# EAGLE design Osilatör (EAGLE 9.6.2)
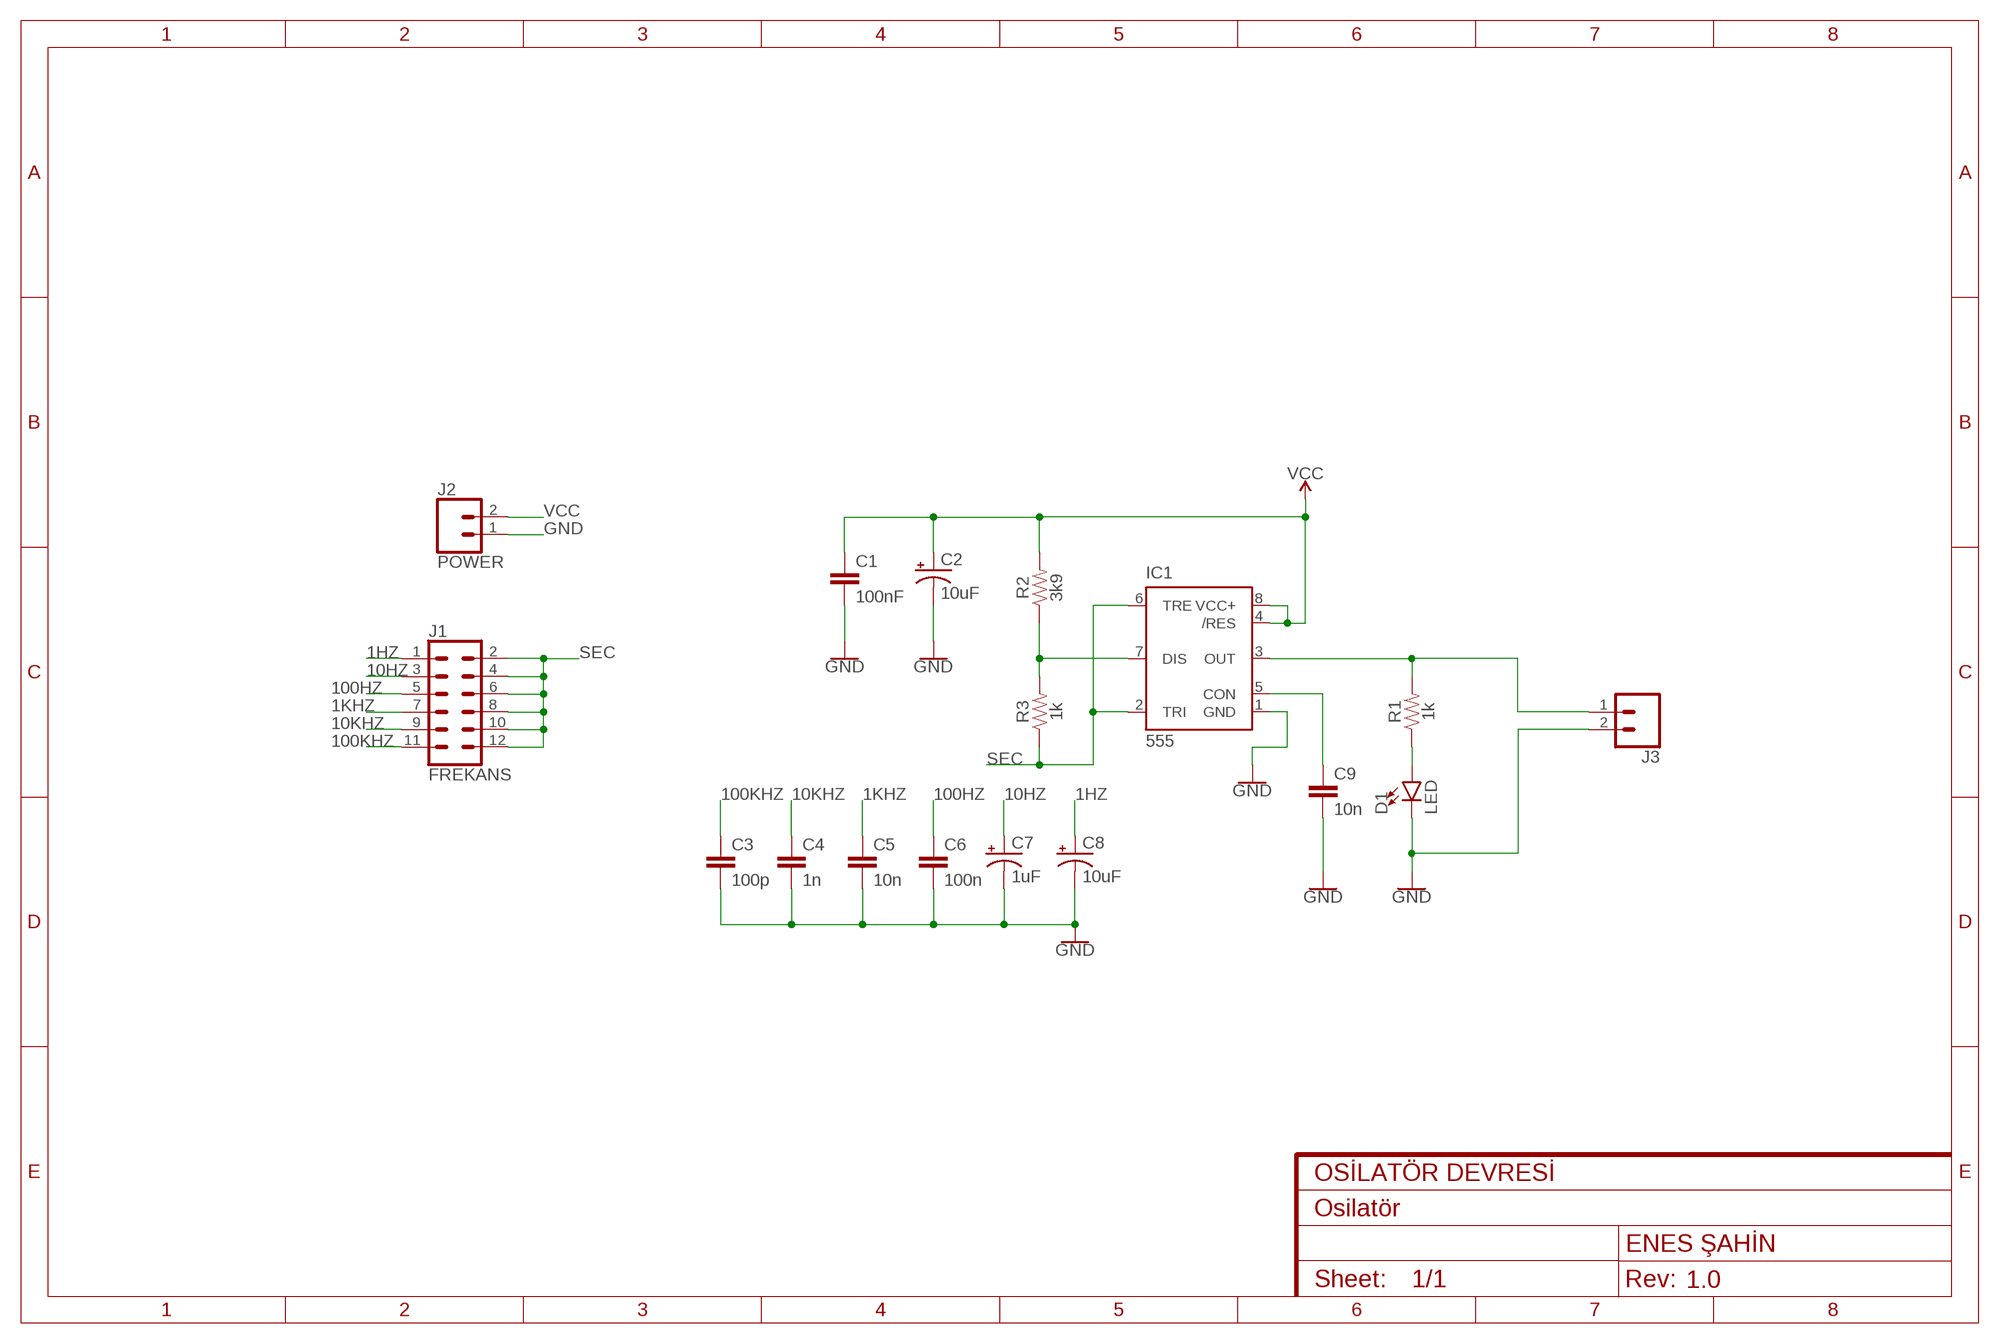
[diagram p0: schematic, sheet 1]
FRAME1 (FRAME-A4L): CNAME: OSİLATÖR DEVRESİ; CREVISION: 1.0; DESIGNER: ENES ŞAHİN

## Parts
C1  100nF  C2,5-3  [C2.5-3]
C2  10uF  100UF-POLAR-RADIAL-2.5MM-25V-20%  [CPOL-RADIAL-2.5MM-6.5MM]
C3  100p  C2,5-3  [C2.5-3]
C4  1n  C2,5-3  [C2.5-3]
C5  10n  C2,5-3  [C2.5-3]
C6  100n  C2,5-3  [C2.5-3]
C7  1uF  100UF-POLAR-RADIAL-2.5MM-25V-20%  [CPOL-RADIAL-2.5MM-6.5MM]
C8  10uF  100UF-POLAR-RADIAL-2.5MM-25V-20%  [CPOL-RADIAL-2.5MM-6.5MM]
C9  10n  C2,5-3  [C2.5-3]
D1  LED  LED-3MM-NO_SILK  [LED_3MM-NS]
IC1  555  555KIT  [DIP08-KIT]
J1  FREKANS  CONN_06X2PTH_FEMALE  [2X6]
J2  POWER  CONN_02  [1X02]
J3  CONN_02  [1X02]
R1  1k  1KOHM-HORIZ-1/4W-1%  [AXIAL-0.3]
R2  3k9  1KOHM-HORIZ-1/4W-1%  [AXIAL-0.3]
R3  1k  1KOHM-HORIZ-1/4W-1%  [AXIAL-0.3]

## Nets
1HZ: C8.1(+) J1.1
1KHZ: C5.1 J1.7
10HZ: C7.1(+) J1.3
10KHZ: C4.1 J1.9
100HZ: C6.1 J1.5
100KHZ: C3.1 J1.11
GND: C1.2 C2.2(-) C3.2 C4.2 C5.2 C6.2 C7.2(-) C8.2(-) C9.2 D1.K(C) IC1.1(GND) J2.1 J3.2
N$1: IC1.3(OUT) J3.1 R1.P$2
N$2: D1.A R1.P$1
N$3: C9.1 IC1.5(CON)
N$7: IC1.7(DIS) R2.P$1 R3.P$2
SEC: IC1.2(TRI) IC1.6(TRE) J1.2 J1.4 J1.6 J1.8 J1.10 J1.12 R3.P$1
VCC: C1.1 C2.1(+) IC1.4(/RES) IC1.8(VCC+) J2.2 R2.P$2

## Library data of the parts
C1 C3-C6 C9 = capacitor-wima:C: CAPACITOR naming: grid - package width
C2 C7 C8 = SparkFun-Capacitors:100UF-POLAR: 100µF polarized capacitors A capacitor is a passive two-terminal electrical component used to store electrical energy temporarily in an electric field.; PROD_ID: CAP-08439; VALUE: 100uF
D1 = SparkFun-LED:LED: LED (Generic) Standard schematic elements and footprints for 5mm, 3mm, 1206, and 0603 sized LEDs. Generic LEDs with no color specified.
IC1 = SparkFun-IC-Special-Function:555: General purpose bipolar Timer Datasheet <http://www.sparkfun.com/datasheets/Components/General/ne555.pdf> SparkFun Products SparkFun SparkPunk Sequencer Kit <https://www.sparkfun.com/products/12707> (KIT-12707) Storefront Component: 555 Timer <https://www.sparkfun.com/products/9273> (COM-09273) Two parts valid for production: VFP: IC-11930 (M7555 PTH) VFP: IC-09173 (555 PTH) - Preferred; PROD_ID: IC-09173; PROD_ID_ALT: IC-11930
J1 = SparkFun-Connectors:CONN_06X2: Multi connection point. Often used as Generic Header-pin footprint for 0.1 inch spaced/style header connections On any of the 0.1 inch spaced packages, you can populate with these: Break Away Headers - Straight <https://www.sparkfun.com/products/116> (PRT-00116) Break Away Male Headers - Right Angle <https://www.sparkfun.com/products/553> (PRT-00553) Female Headers <https://www.sparkfun.com/products/115> (PRT-00115) Break Away Headers - Machine Pin <https://www.sparkfun.com/products/117> (PRT-00117) Break Away Female Headers - Swiss Machine Pin <https://www.sparkfun.com/products/743> (PRT-00743); PROD_ID: CONN-12423; VALUE: 2X6 FEMALE
J2 J3 = SparkFun-Connectors:CONN_02: Multi connection point. Often used as Generic Header-pin footprint for 0.1 inch spaced/style header connections On any of the 0.1 inch spaced packages, you can populate with these: Break Away Headers - Straight <https://www.sparkfun.com/products/116> (PRT-00116) Break Away Male Headers - Right Angle <https://www.sparkfun.com/products/553> (PRT-00553) Female Headers <https://www.sparkfun.com/products/115> (PRT-00115) Break Away Headers - Machine Pin <https://www.sparkfun.com/products/117> (PRT-00117) Break Away Female Headers - Swiss Machine Pin <https://www.sparkfun.com/products/743> (PRT-00743) For SCREWTERMINALS and SPRING TERMINALS visit here: Screw Terimnals on SparkFun.com <https://www.sparkfun.com/search/results?term=Screw+Terminals> (5mm/3.5mm/2.54mm spacing) This device is also useful as a general connection point to wire up your design to another part of your project. Our various solder wires solder well into these plated through hole pads. Hook-Up Wire - Assortment (Stranded, 22 AWG) <https://www.sparkfun.com/products/11375> (PRT-11375) Hook-Up Wire - Assortment (Solid Core, 22 AWG) <https://www.sparkfun.com/products/11367> (PRT-11367) View the entire wire category on our website here <https://www.sparkfun.com/categories/141> Special notes: Molex polarized connector foot print use with: PRT-08233 with associated crimp pins and housings. 2.54_SCREWTERM for use with PRT-10571. 3.5mm Screw Terminal footprints for PRT-08084 5mm Screw Terminal footprints for use with PRT-08432
R1 R3 = SparkFun-Resistors:1KOHM: 1kΩ resistor A resistor is a passive two-terminal electrical component that implements electrical resistance as a circuit element. Resistors act to reduce current flow, and, at the same time, act to lower voltage levels within circuits. - Wikipedia; PROD_ID: RES-12182
R2 = SparkFun-Resistors:1KOHM: 1kΩ resistor A resistor is a passive two-terminal electrical component that implements electrical resistance as a circuit element. Resistors act to reduce current flow, and, at the same time, act to lower voltage levels within circuits. - Wikipedia; PROD_ID: RES-12182; VALUE: 1k

## Board
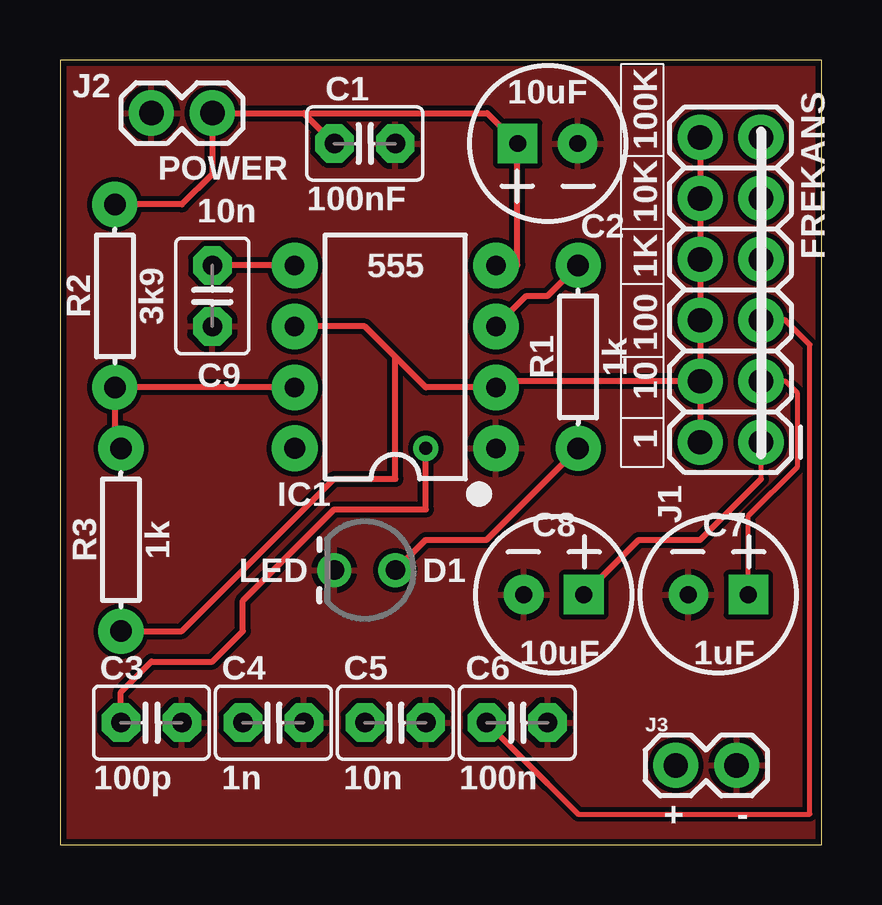
[diagram p1: board, top side]
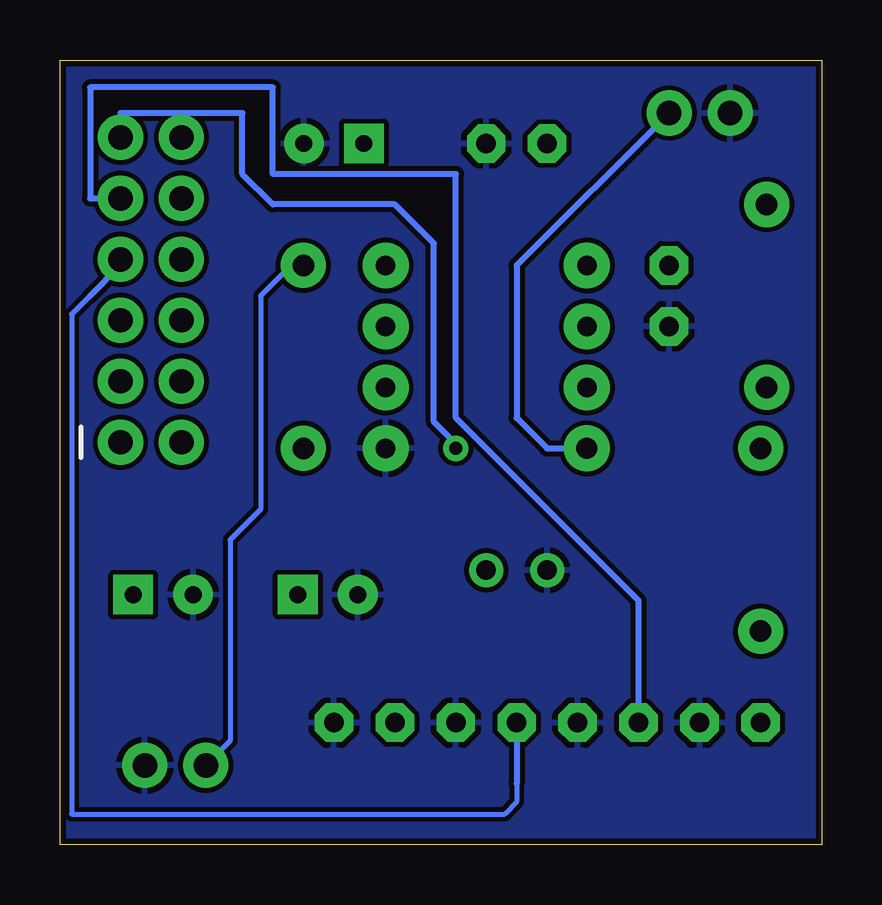
[diagram p2: board, bottom side, seen from below]

Size 31.73 x 32.69 mm. Coordinates in mm from the lower left corner, seen from the top.
Outline: 0,0 31.73,0 31.73,32.69 0,32.69 0,0
Copper layers (1*16): Top 0.035mm / dielectric 1.5mm / Bottom 0.035mm
Design rules "SparkFun": minimum track width 8mil, minimum drill 20mil, track to track 8mil, track to pad 8mil, pad to pad 8mil, via to via 8mil, smd to smd 8mil, copper to edge 10mil, drill to drill 8mil, minimum pad ring 12mil, minimum via ring 10mil, stop-mask expansion 4mil, vias tented up to drill 25mil, thermal gap 10mil

### Footprints (pad centres in the part's own frame; a part is rotated, then mirrored left to right if it is on the bottom)
C2.5-3 = drill 0.813 pad 1.6 octagon: 1 -1.27,0; 2 1.27,0
CPOL-RADIAL-2.5MM-6.5MM = drill 0.7 pad 1.651 square: 1 1.25,0 | drill 0.7 pad 1.651: 2 -1.25,0
LED_3MM-NS = drill 0.813: A -1.27,0; K 1.27,0
DIP08-KIT = drill 0.813 pad 1.905: 1 -3.81,-4.191; 2 -1.27,-4.191; 3 1.27,-4.191; 4 3.81,-4.191; 5 3.81,4.191; 6 1.27,4.191; 7 -1.27,4.191 | drill 0.864 pad 1.905: 8 -3.81,4.191
2X6 = drill 1.016 pad 1.88: 1 0,0; 2 0,2.54; 3 2.54,0; 4 2.54,2.54; 5 5.08,0; 6 5.08,2.54; 7 7.62,0; 8 7.62,2.54; 9 10.16,0; 10 10.16,2.54; 11 12.7,0; 12 12.7,2.54
1X02 = drill 1.016 pad 1.88: 1 0,0; 2 2.54,0
AXIAL-0.3 = drill 0.9 pad 1.88: P$1 -3.81,0; P$2 3.81,0

### Placement (x,y rotation side)
C1  12.7,29.21 0 top
C2  20.32,29.21 180 top
C3  3.81,5.08 0 top
C4  8.89,5.08 0 top
C5  13.97,5.08 0 top
C6  19.05,5.08 0 top
C7  27.43,10.41 0 top
C8  20.57,10.41 0 top
C9  6.35,22.86 270 top
D1  12.7,11.43 180 top
IC1  13.97,20.32 90 top
J1  29.21,16.76 90 top
J2  3.81,30.48 0 top
J3  25.65,3.3 0 top
R1  21.59,20.32 90 top
R2  2.29,22.86 90 top
R3  2.54,12.7 90 top

### Tracks (layer width: path | path; a pad name or v marks a point on that pad's centre or on a via)
1HZ
  Top 0.203: 29.21,15.24 J1.1
  Top 0.254: C8.1 24.11,12.7 26.67,12.7 29.21,15.24
1KHZ
  Bottom 0.203: 12.7,2.54 12.7,1.78 13.21,1.27 31.24,1.27 31.24,22.1 30.48,22.86
  Bottom 0.254: C5.1 12.7,2.54 | 30.48,22.86 29.21,24.13 J1.7
10HZ
  Top 0.203: C7.1 28.68,13.7 30.73,15.75 30.73,18.8 30.23,19.3 J1.3
  Top 0.254: C7.1 29.21,10.94
10KHZ
  Bottom 0.254: C4.1 7.62,10.16 15.24,17.78 15.24,27.94 22.86,27.94 22.86,31.55 30.48,31.55 30.48,26.92 J1.9
100HZ
  Top 0.203: 20.32,2.54 21.59,1.27 31.24,1.27 31.24,20.83 30.23,21.84
  Top 0.254: C6.1 20.32,2.54 | 30.23,21.84 J1.5
100KHZ  (via drill 0.55)
  Top 0.254: C3.1 2.54,6.35 3.81,7.62 6.35,7.62 7.62,8.89 7.62,10.16 11.43,13.97 15.24,13.97 v15.24,16.51
  Bottom 0.254: v15.24,16.51 15.24,16.7 16.15,17.61 16.15,25.04 17.78,26.67 22.86,26.67 24.13,27.94 24.13,30.48 29.21,30.48 J1.11
GND
  pour Top: -1.27,33.02 33.02,33.02 33.02,-1.27 -1.27,-1.27
  pour Bottom: -2.54,34.29 34.29,34.29 34.29,-2.54 -2.54,-2.54
N$1
  Top 0.254: IC1.3 19.43,22.86 20.32,22.86 R1.P$2
  Bottom 0.203: R1.P$2 22.1,24.13 23.37,22.86 23.37,13.97 24.64,12.7 24.64,4.32 J3.1
N$2
  Top 0.254: D1.A 15.24,12.7 17.78,12.7 R1.P$1
N$3
  Top 0.254: IC1.5 C9.1
N$7
  Top 0.254: R3.P$2 2.29,16.76 R2.P$1 IC1.7
SEC
  Top 0.254: R3.P$1 5.08,8.89 11.43,15.24 13.97,15.24 13.97,20.32 | 13.97,20.32 12.7,21.59 IC1.6 | 13.97,20.32 15.24,19.05 IC1.2 18.41,19.3 J1.4 | J1.12 J1.10 J1.8 J1.6 J1.4 | J1.4 J1.2
VCC
  Top 0.254: 10.16,30.48 J2.2 6.35,27.94 5.08,26.67 R2.P$2 | 10.16,30.48 C1.1 | C2.1 17.8,30.48 10.16,30.48 | C2.1 | IC1.4 19.05,24.13 19.06,24.14 C2.1
  Bottom 0.254: J2.2 12.7,24.13 12.7,17.78 11.43,16.51 IC1.8

### Text on the board
tNames: 100K | 10K | 1K | 100 | 10 | 1 | + | -